# Altium schematic sheet 02_CPU.SchDoc
size A3
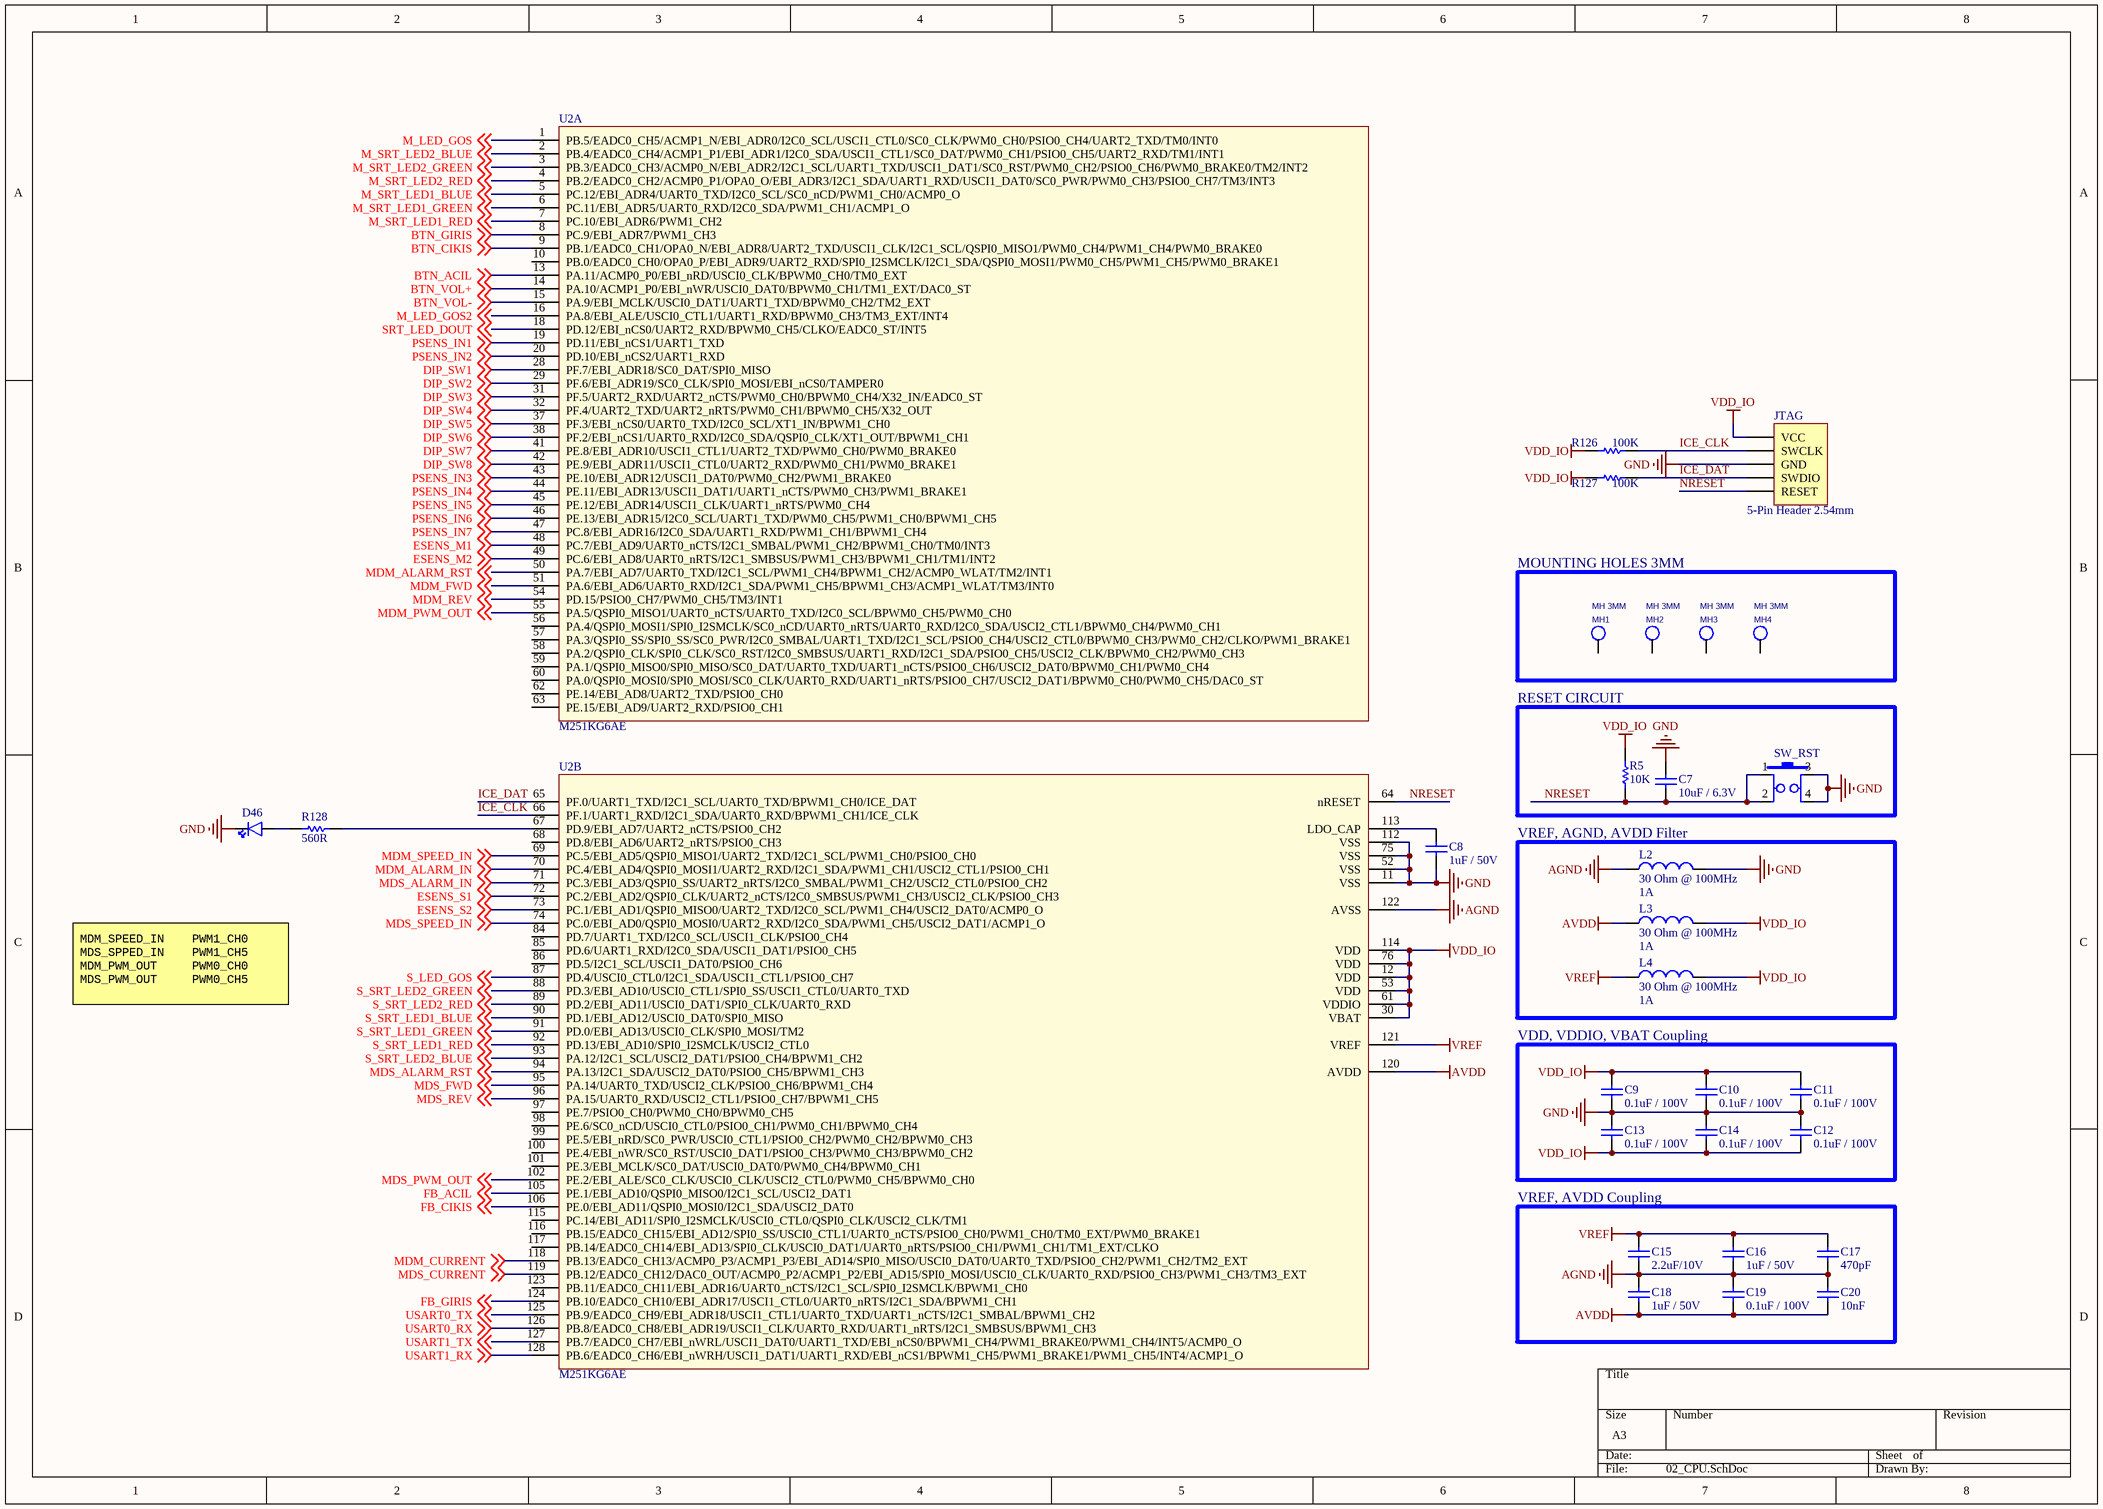
[diagram p0: 02_CPU.SchDoc]

## Parts
C7  10uF / 6.3V  [603C]
C8  1uF / 50V  [603C]
C9  0.1uF / 100V  [603C]
C10  0.1uF / 100V  [603C]
C11  0.1uF / 100V  [603C]
C12  0.1uF / 100V  [603C]
C13  0.1uF / 100V  [603C]
C14  0.1uF / 100V  [603C]
C15  2.2uF/10V  [603C]
C16  1uF / 50V  [603C]
C17  470pF  [603C]
C18  1uF / 50V  [603C]
C19  0.1uF / 100V  [603C]
C20  10nF  [603C]
D46  led_green  [805LED]  (value not drawn)
JTAG  5-Pin Header 2.54mm  [HDR1X5]  (no BOM)
L2  Current Rating (Max): 1A  [603L]  (hidden comment: 30 Ohm @ 100MHz)
L3  Current Rating (Max): 1A  [603L]  (hidden comment: 30 Ohm @ 100MHz)
L4  Current Rating (Max): 1A  [603L]  (hidden comment: 30 Ohm @ 100MHz)
MH1  MH 3MM  [MH 3.0MM HOLE 5MM PAD]  (no BOM)
MH2  MH 3MM  [MH 3.0MM HOLE 5MM PAD]  (no BOM)
MH3  MH 3MM  [MH 3.0MM HOLE 5MM PAD]  (no BOM)
MH4  MH 3MM  [MH 3.0MM HOLE 5MM PAD]  (no BOM)
R5  10K  [603R]
R126  100K  [603R]
R127  100K  [603R]
R128  560R  [603R]
SW_RST  switch tactile  [SW_TACTILE_6X6mm SMT]  (value not drawn)
U2  M251KG6AE  [TSQFP40P1600X1600X160-128N]  (parts A,B of 2)

## Blocks framed on the sheet
MOUNTING HOLES 3MM: MH1-MH4
RESET CIRCUIT: C7 R5 SW_RST
VREF, AGND, AVDD Filter: L2-L4
VDD, VDDIO, VBAT Coupling: C9-C14
VREF, AVDD Coupling: C15-C20

## Nets
AGND: C15.1 C16.1 C17.1 C18.2 C19.2 C20.2 L2.1 U2.122(AVSS)
AVDD: C18.1 C19.1 C20.1 L3.1 U2.120(AVDD)
GND: C7.1 C8.1 C9.1 C10.1 C11.1 C12.1 C13.2 C14.2 D46.2(K) JTAG.3(GND) L2.2 SW_RST.3 SW_RST.4 U2.11(VSS) U2.52(VSS) U2.75(VSS) U2.112(VSS)
VDD_IO: C9.2 C10.2 C11.2 C12.2 C13.1 C14.1 JTAG.1(VCC) L3.2 L4.2 R5.2 R126.1 R127.1 U2.12(VDD) U2.30(VBAT) U2.53(VDD) U2.61(VDDIO) U2.76(VDD) U2.114(VDD)
VREF: C15.2 C16.2 C17.2 L4.1 U2.121(VREF)
BTN_ACIL: U2.13(PA.11/ACMP0_P0/EBI_nRD/USCI0_CLK/BPWM0_CH0/TM0_EXT) ; off-sheet BTN_ACIL
BTN_CIKIS: U2.9(PB.1/EADC0_CH1/OPA0_N/EBI_ADR8/UART2_TXD/USCI1_CLK/I2C1_SCL/QSPI0_MISO1/PWM0_CH4/PWM1_CH4/PWM0_BRAKE0) ; off-sheet BTN_CIKIS
BTN_GIRIS: U2.8(PC.9/EBI_ADR7/PWM1_CH3) ; off-sheet BTN_GIRIS
BTN_VOL+: U2.14(PA.10/ACMP1_P0/EBI_nWR/USCI0_DAT0/BPWM0_CH1/TM1_EXT/DAC0_ST) ; off-sheet BTN_VOL+
BTN_VOL-: U2.15(PA.9/EBI_MCLK/USCI0_DAT1/UART1_TXD/BPWM0_CH2/TM2_EXT) ; off-sheet BTN_VOL-
DIP_SW1: U2.28(PF.7/EBI_ADR18/SC0_DAT/SPI0_MISO) ; off-sheet DIP_SW1
DIP_SW2: U2.29(PF.6/EBI_ADR19/SC0_CLK/SPI0_MOSI/EBI_nCS0/TAMPER0) ; off-sheet DIP_SW2
DIP_SW3: U2.31(PF.5/UART2_RXD/UART2_nCTS/PWM0_CH0/BPWM0_CH4/X32_IN/EADC0_ST) ; off-sheet DIP_SW3
DIP_SW4: U2.32(PF.4/UART2_TXD/UART2_nRTS/PWM0_CH1/BPWM0_CH5/X32_OUT) ; off-sheet DIP_SW4
DIP_SW5: U2.37(PF.3/EBI_nCS0/UART0_TXD/I2C0_SCL/XT1_IN/BPWM1_CH0) ; off-sheet DIP_SW5
DIP_SW6: U2.38(PF.2/EBI_nCS1/UART0_RXD/I2C0_SDA/QSPI0_CLK/XT1_OUT/BPWM1_CH1) ; off-sheet DIP_SW6
DIP_SW7: U2.41(PE.8/EBI_ADR10/USCI1_CTL1/UART2_TXD/PWM0_CH0/PWM0_BRAKE0) ; off-sheet DIP_SW7
DIP_SW8: U2.42(PE.9/EBI_ADR11/USCI1_CTL0/UART2_RXD/PWM0_CH1/PWM0_BRAKE1) ; off-sheet DIP_SW8
ESENS_M1: U2.48(PC.7/EBI_AD9/UART0_nCTS/I2C1_SMBAL/PWM1_CH2/BPWM1_CH0/TM0/INT3) ; off-sheet ESENS_M1
ESENS_M2: U2.49(PC.6/EBI_AD8/UART0_nRTS/I2C1_SMBSUS/PWM1_CH3/BPWM1_CH1/TM1/INT2) ; off-sheet ESENS_M2
ESENS_S1: U2.72(PC.2/EBI_AD2/QSPI0_CLK/UART2_nCTS/I2C0_SMBSUS/PWM1_CH3/USCI2_CLK/PSIO0_CH3) ; off-sheet ESENS_S1
ESENS_S2: U2.73(PC.1/EBI_AD1/QSPI0_MISO0/UART2_TXD/I2C0_SCL/PWM1_CH4/USCI2_DAT0/ACMP0_O) ; off-sheet ESENS_S2
FB_ACIL: U2.105(PE.1/EBI_AD10/QSPI0_MISO0/I2C1_SCL/USCI2_DAT1) ; off-sheet FB_ACIL
FB_CIKIS: U2.106(PE.0/EBI_AD11/QSPI0_MOSI0/I2C1_SDA/USCI2_DAT0) ; off-sheet FB_CIKIS
FB_GIRIS: U2.124(PB.10/EADC0_CH10/EBI_ADR17/USCI1_CTL0/UART0_nRTS/I2C1_SDA/BPWM1_CH1) ; off-sheet FB_GIRIS
ICE_CLK: JTAG.2(SWCLK) R126.2 U2.66(PF.1/UART1_RXD/I2C1_SDA/UART0_RXD/BPWM1_CH1/ICE_CLK)
ICE_DAT: JTAG.4(SWDIO) R127.2 U2.65(PF.0/UART1_TXD/I2C1_SCL/UART0_TXD/BPWM1_CH0/ICE_DAT)
M_LED_GOS: U2.1(PB.5/EADC0_CH5/ACMP1_N/EBI_ADR0/I2C0_SCL/USCI1_CTL0/SC0_CLK/PWM0_CH0/PSIO0_CH4/UART2_TXD/TM0/INT0) ; off-sheet M_LED_GOS
M_LED_GOS2: U2.16(PA.8/EBI_ALE/USCI0_CTL1/UART1_RXD/BPWM0_CH3/TM3_EXT/INT4) ; off-sheet M_LED_GOS2
M_SRT_LED1_BLUE: U2.5(PC.12/EBI_ADR4/UART0_TXD/I2C0_SCL/SC0_nCD/PWM1_CH0/ACMP0_O) ; off-sheet M_SRT_LED1_BLUE
M_SRT_LED1_GREEN: U2.6(PC.11/EBI_ADR5/UART0_RXD/I2C0_SDA/PWM1_CH1/ACMP1_O) ; off-sheet M_SRT_LED1_GREEN
M_SRT_LED1_RED: U2.7(PC.10/EBI_ADR6/PWM1_CH2) ; off-sheet M_SRT_LED1_RED
M_SRT_LED2_BLUE: U2.2(PB.4/EADC0_CH4/ACMP1_P1/EBI_ADR1/I2C0_SDA/USCI1_CTL1/SC0_DAT/PWM0_CH1/PSIO0_CH5/UART2_RXD/TM1/INT1) ; off-sheet M_SRT_LED2_BLUE
M_SRT_LED2_GREEN: U2.3(PB.3/EADC0_CH3/ACMP0_N/EBI_ADR2/I2C1_SCL/UART1_TXD/USCI1_DAT1/SC0_RST/PWM0_CH2/PSIO0_CH6/PWM0_BRAKE0/TM2/INT2) ; off-sheet M_SRT_LED2_GREEN
M_SRT_LED2_RED: U2.4(PB.2/EADC0_CH2/ACMP0_P1/OPA0_O/EBI_ADR3/I2C1_SDA/UART1_RXD/USCI1_DAT0/SC0_PWR/PWM0_CH3/PSIO0_CH7/TM3/INT3) ; off-sheet M_SRT_LED2_RED
MDM_ALARM_IN: U2.70(PC.4/EBI_AD4/QSPI0_MOSI1/UART2_RXD/I2C1_SDA/PWM1_CH1/USCI2_CTL1/PSIO0_CH1) ; off-sheet MDM_ALARM_IN
MDM_ALARM_RST: U2.50(PA.7/EBI_AD7/UART0_TXD/I2C1_SCL/PWM1_CH4/BPWM1_CH2/ACMP0_WLAT/TM2/INT1) ; off-sheet MDM_ALARM_RST
MDM_CURRENT: U2.118(PB.13/EADC0_CH13/ACMP0_P3/ACMP1_P3/EBI_AD14/SPI0_MISO/USCI0_DAT0/UART0_TXD/PSIO0_CH2/PWM1_CH2/TM2_EXT) ; off-sheet MDM_CURRENT
MDM_FWD: U2.51(PA.6/EBI_AD6/UART0_RXD/I2C1_SDA/PWM1_CH5/BPWM1_CH3/ACMP1_WLAT/TM3/INT0) ; off-sheet MDM_FWD
MDM_PWM_OUT: U2.55(PA.5/QSPI0_MISO1/UART0_nCTS/UART0_TXD/I2C0_SCL/BPWM0_CH5/PWM0_CH0) ; off-sheet MDM_PWM_OUT
MDM_REV: U2.54(PD.15/PSIO0_CH7/PWM0_CH5/TM3/INT1) ; off-sheet MDM_REV
MDM_SPEED_IN: U2.69(PC.5/EBI_AD5/QSPI0_MISO1/UART2_TXD/I2C1_SCL/PWM1_CH0/PSIO0_CH0) ; off-sheet MDM_SPEED_IN
MDS_ALARM_IN: U2.71(PC.3/EBI_AD3/QSPI0_SS/UART2_nRTS/I2C0_SMBAL/PWM1_CH2/USCI2_CTL0/PSIO0_CH2) ; off-sheet MDS_ALARM_IN
MDS_ALARM_RST: U2.94(PA.13/I2C1_SDA/USCI2_DAT0/PSIO0_CH5/BPWM1_CH3) ; off-sheet MDS_ALARM_RST
MDS_CURRENT: U2.119(PB.12/EADC0_CH12/DAC0_OUT/ACMP0_P2/ACMP1_P2/EBI_AD15/SPI0_MOSI/USCI0_CLK/UART0_RXD/PSIO0_CH3/PWM1_CH3/TM3_EXT) ; off-sheet MDS_CURRENT
MDS_FWD: U2.95(PA.14/UART0_TXD/USCI2_CLK/PSIO0_CH6/BPWM1_CH4) ; off-sheet MDS_FWD
MDS_PWM_OUT: U2.102(PE.2/EBI_ALE/SC0_CLK/USCI0_CLK/USCI2_CTL0/PWM0_CH5/BPWM0_CH0) ; off-sheet MDS_PWM_OUT
MDS_REV: U2.96(PA.15/UART0_RXD/USCI2_CTL1/PSIO0_CH7/BPWM1_CH5) ; off-sheet MDS_REV
MDS_SPEED_IN: U2.74(PC.0/EBI_AD0/QSPI0_MOSI0/UART2_RXD/I2C0_SDA/PWM1_CH5/USCI2_DAT1/ACMP1_O) ; off-sheet MDS_SPEED_IN
NRESET: C7.2 JTAG.5(RESET) R5.1 SW_RST.1 SW_RST.2 U2.64(nRESET)
PSENS_IN1: U2.19(PD.11/EBI_nCS1/UART1_TXD) ; off-sheet PSENS_IN1
PSENS_IN2: U2.20(PD.10/EBI_nCS2/UART1_RXD) ; off-sheet PSENS_IN2
PSENS_IN3: U2.43(PE.10/EBI_ADR12/USCI1_DAT0/PWM0_CH2/PWM1_BRAKE0) ; off-sheet PSENS_IN3
PSENS_IN4: U2.44(PE.11/EBI_ADR13/USCI1_DAT1/UART1_nCTS/PWM0_CH3/PWM1_BRAKE1) ; off-sheet PSENS_IN4
PSENS_IN5: U2.45(PE.12/EBI_ADR14/USCI1_CLK/UART1_nRTS/PWM0_CH4) ; off-sheet PSENS_IN5
PSENS_IN6: U2.46(PE.13/EBI_ADR15/I2C0_SCL/UART1_TXD/PWM0_CH5/PWM1_CH0/BPWM1_CH5) ; off-sheet PSENS_IN6
PSENS_IN7: U2.47(PC.8/EBI_ADR16/I2C0_SDA/UART1_RXD/PWM1_CH1/BPWM1_CH4) ; off-sheet PSENS_IN7
S_LED_GOS: U2.87(PD.4/USCI0_CTL0/I2C1_SDA/USCI1_CTL1/PSIO0_CH7) ; off-sheet S_LED_GOS
S_SRT_LED1_BLUE: U2.90(PD.1/EBI_AD12/USCI0_DAT0/SPI0_MISO) ; off-sheet S_SRT_LED1_BLUE
S_SRT_LED1_GREEN: U2.91(PD.0/EBI_AD13/USCI0_CLK/SPI0_MOSI/TM2) ; off-sheet S_SRT_LED1_GREEN
S_SRT_LED1_RED: U2.92(PD.13/EBI_AD10/SPI0_I2SMCLK/USCI2_CTL0) ; off-sheet S_SRT_LED1_RED
S_SRT_LED2_BLUE: U2.93(PA.12/I2C1_SCL/USCI2_DAT1/PSIO0_CH4/BPWM1_CH2) ; off-sheet S_SRT_LED2_BLUE
S_SRT_LED2_GREEN: U2.88(PD.3/EBI_AD10/USCI0_CTL1/SPI0_SS/USCI1_CTL0/UART0_TXD) ; off-sheet S_SRT_LED2_GREEN
S_SRT_LED2_RED: U2.89(PD.2/EBI_AD11/USCI0_DAT1/SPI0_CLK/UART0_RXD) ; off-sheet S_SRT_LED2_RED
SRT_LED_DOUT: U2.18(PD.12/EBI_nCS0/UART2_RXD/BPWM0_CH5/CLKO/EADC0_ST/INT5) ; off-sheet SRT_LED_DOUT
USART0_RX: U2.126(PB.8/EADC0_CH8/EBI_ADR19/USCI1_CLK/UART0_RXD/UART1_nRTS/I2C1_SMBSUS/BPWM1_CH3) ; off-sheet USART0_RX
USART0_TX: U2.125(PB.9/EADC0_CH9/EBI_ADR18/USCI1_CTL1/UART0_TXD/UART1_nCTS/I2C1_SMBAL/BPWM1_CH2) ; off-sheet USART0_TX
USART1_RX: U2.128(PB.6/EADC0_CH6/EBI_nWRH/USCI1_DAT1/UART1_RXD/EBI_nCS1/BPWM1_CH5/PWM1_BRAKE1/PWM1_CH5/INT4/ACMP1_O) ; off-sheet USART1_RX
USART1_TX: U2.127(PB.7/EADC0_CH7/EBI_nWRL/USCI1_DAT0/UART1_TXD/EBI_nCS0/BPWM1_CH4/PWM1_BRAKE0/PWM1_CH4/INT5/ACMP0_O) ; off-sheet USART1_TX
NetC8_2: C8.2 U2.113(LDO_CAP)
NetD46_1: D46.1(A) R128.2
NetR128_1: R128.1 U2.67(PD.9/EBI_AD7/UART2_nCTS/PSIO0_CH2)

Not connected (* = marked no-connect by the designer): MH1 1; MH2 1; MH3 1; MH4 1; U2 10(PB.0/EADC0_CH0/OPA0_P/EBI_ADR9/UART2_RXD/SPI0_I2SMCLK/I2C1_SDA/QSPI0_MOSI1/PWM0_CH5/PWM1_CH5/PWM0_BRAKE1) 56(PA.4/QSPI0_MOSI1/SPI0_I2SMCLK/SC0_nCD/UART0_nRTS/UART0_RXD/I2C0_SDA/USCI2_CTL1/BPWM0_CH4/PWM0_CH1) 57(PA.3/QSPI0_SS/SPI0_SS/SC0_PWR/I2C0_SMBAL/UART1_TXD/I2C1_SCL/PSIO0_CH4/USCI2_CTL0/BPWM0_CH3/PWM0_CH2/CLKO/PWM1_BRAKE1) 58(PA.2/QSPI0_CLK/SPI0_CLK/SC0_RST/I2C0_SMBSUS/UART1_RXD/I2C1_SDA/PSIO0_CH5/USCI2_CLK/BPWM0_CH2/PWM0_CH3) 59(PA.1/QSPI0_MISO0/SPI0_MISO/SC0_DAT/UART0_TXD/UART1_nCTS/PSIO0_CH6/USCI2_DAT0/BPWM0_CH1/PWM0_CH4) 60(PA.0/QSPI0_MOSI0/SPI0_MOSI/SC0_CLK/UART0_RXD/UART1_nRTS/PSIO0_CH7/USCI2_DAT1/BPWM0_CH0/PWM0_CH5/DAC0_ST) 62(PE.14/EBI_AD8/UART2_TXD/PSIO0_CH0) 63(PE.15/EBI_AD9/UART2_RXD/PSIO0_CH1) 68(PD.8/EBI_AD6/UART2_nRTS/PSIO0_CH3) 84(PD.7/UART1_TXD/I2C0_SCL/USCI1_CLK/PSIO0_CH4) 85(PD.6/UART1_RXD/I2C0_SDA/USCI1_DAT1/PSIO0_CH5) 86(PD.5/I2C1_SCL/USCI1_DAT0/PSIO0_CH6) 97(PE.7/PSIO0_CH0/PWM0_CH0/BPWM0_CH5) 98(PE.6/SC0_nCD/USCI0_CTL0/PSIO0_CH1/PWM0_CH1/BPWM0_CH4) 99(PE.5/EBI_nRD/SC0_PWR/USCI0_CTL1/PSIO0_CH2/PWM0_CH2/BPWM0_CH3) 100(PE.4/EBI_nWR/SC0_RST/USCI0_DAT1/PSIO0_CH3/PWM0_CH3/BPWM0_CH2) 101(PE.3/EBI_MCLK/SC0_DAT/USCI0_DAT0/PWM0_CH4/BPWM0_CH1) 115(PC.14/EBI_AD11/SPI0_I2SMCLK/USCI0_CTL0/QSPI0_CLK/USCI2_CLK/TM1) 116(PB.15/EADC0_CH15/EBI_AD12/SPI0_SS/USCI0_CTL1/UART0_nCTS/PSIO0_CH0/PWM1_CH0/TM0_EXT/PWM0_BRAKE1) 117(PB.14/EADC0_CH14/EBI_AD13/SPI0_CLK/USCI0_DAT1/UART0_nRTS/PSIO0_CH1/PWM1_CH1/TM1_EXT/CLKO) 123(PB.11/EADC0_CH11/EBI_ADR16/UART0_nCTS/I2C1_SCL/SPI0_I2SMCLK/BPWM1_CH0)

## Notes on the sheet
- MDM_SPEED_IN    PWM1_CH0
  MDS_SPPED_IN    PWM1_CH5
  MDM_PWM_OUT     PWM0_CH0
  MDS_PWM_OUT     PWM0_CH5

## Library data of the parts
C7 = CAP_CER 10UF 6.3V X5R 0603: 10µF ±20% 6.3V Ceramic Capacitor X5R 0603 (1608 Metric); Manufacturer: Samsung Electro-Mechanics; Manufacturer Part Number: CL10A106MQ8NNNC; Tolerance: ±10%; Value: 10uF / 6.3V; Digi-Key Part Number: 1276-1119-1-ND; Voltage - Rated: 6.3V; Temperature Coefficient: X5R; Operating Temperature: -55°C ~ 85°C; Applications: General Purpose; Package / Case: 0603 (1608 Metric)
C8 C16 C18 = CAP CER 1UF 50V X5R 0603: 1µF ±10% 50V Ceramic Capacitor X5R 0603 (1608 Metric); Manufacturer: Samsung Electro-Mechanics; Value: 1uF / 50V; Digi-Key Part Number: 1276-1860-2-ND; Tolerance: ±10%; Voltage - Rated: 50V; Temperature Coefficient: X5R; Operating Temperature: -55°C ~ 85°C; Applications: General Purpose; Package / Case: 0603 (1608 Metric)
C9-C14 C19 = CAP CER 0.1UF 100V X7R 0603: 0.1 µF ±10% 100V Ceramic Capacitor X7R 0603 (1608 Metric); Manufacturer: Venkel; Manufacturer Part Number: C0603X7R101-104KNP; Value: 0.1uF / 100V; Digi-Key Part Number: 2679-C0603X7R101-104KNPTR-ND; Tolerance: ±10%; Voltage - Rated: 100V; Temperature Coefficient: X7R; Operating Temperature: -55°C ~ 125°C; Applications: General Purpose; Package / Case: 0603 (1608 Metric)
C15 = CAP CER 2.2UF 10V X5R 0603: 2.2 µF ±10% 10V Ceramic Capacitor X5R 0603 (1608 Metric); Manufacturer: CAL-CHIP ELECTRONICS, INC.; Manufacturer Part Number: GMC10X5R225K10NT; Value: 2.2uF/10V; Digi-Key Part Number: 2571-GMC10X5R225K10NTTR-ND; Tolerance: ±10%; Voltage - Rated: 10V; Temperature Coefficient: X5R; Operating Temperature: -55°C ~ 85°C; Applications: General Purpose; Package / Case: 0603 (1608 Metric)
C17 = CAP_CER_470pF_50V_%5_C0G_NP0_ 0603: 470pF ±5% 50V Ceramic Capacitor C0G, NP0 0603 (1608 Metric); Manufacturer: Samsung Electro-Mechanics America, Inc.; Manufacturer Part Number: CL10C471JB8NNNC; Value: 470pF; Digi-Key Part Number: 1276-1168-2-ND; Tolerance: ±5%; Voltage - Rated: 50V; Temperature Coefficient: C0G, NP0; Operating Temperature: -55°C ~ 125°C; Applications: General Purpose; Package / Case: 0603 (1608 Metric); Size / Dimension: 0.063" L x 0.032" W (1.60mm x 0.80mm); Thickness (Max): 0.035" (0.90mm)
C20 = CAP_CER_10nF_50V_%5_ X7R_ 0603: 10nF ±5% 50V Ceramic Capacitor X7R 0603 (1608 Metric); Manufacturer: Yageo; Manufacturer Part Number: CC0603JRX7R9BB103; Value: 10nF; Digi-Key Part Number: 311-1778-2-ND; Tolerance: ±5%; Voltage - Rated: 50V; Temperature Coefficient: X7R; Operating Temperature: -55°C ~ 125°C; Applications: General Purpose; Package / Case: 0603 (1608 Metric); Size / Dimension: 0.063" L x 0.032" W (1.60mm x 0.80mm); Thickness (Max): 0.035" (0.90mm)
D46 = LED_GREEN_0805: LED 2X1.2MM 570NM GN WTR CLR SMD; Millicandela Rating: 50mcd; Voltage - Forward (Vf): 2.1V; value: led_green; Digi-Key Part Number: 754-1127-1-ND; Case: 0805; Viewing Angle: -
JTAG = STM_JTAG: STM JTAG Header, 5-Pin; Value: 5-Pin Header 2.54mm
L2-L4 = FERRITE BEAD 30 OHM 0603 1LN: 30 Ohms @ 100 MHz 1 Power Line Ferrite Bead 0603 (1608 Metric) 1A 50mOhm; Manufacturer: Murata Electronics; Manufacturer Part Number: BLM18PG300SN1D; Digi-Key Part Number: 490-1035-1-ND; Operating Temperature: -55°C ~ 125°C; Package / Case: 0603 (1608 Metric); Height (Max): 0.037" (0.95mm); Size / Dimension: 0.063" L x 0.032" W (1.60mm x 0.80mm); DC Resistance (DCR) (Max): 50mOhm; Impedance at Frequency: 30 Ohm @ 100MHz
MH1-MH4 = MH 3MMHOLE_5MMPAD: Mountin hole, NPTH Drill 3mm
R5 = RES_10K_OHM_%5_0.1W_0603: 10 kOhms ±5% 0.1W, 1/10W Chip Resistor 0603 (1608 Metric) Moisture Resistant Thick Film; Manufacturer: Yageo; Manufacturer Part Number: RC0603JR-0710KL; Temperature Coefficient: ±100ppm/°C; Value: 10K; Digi-Key Part Number: 311-10KGRTR-ND; Tolerance: ±5%; Power (Watts): 0.1W, 1/10W; Composition: Thick Film; Operating Temperature: -55°C ~ 155°C; Package / Case: 0603 (1608 Metric); Size / Dimension: 0.063" L x 0.032" W (1.60mm x 0.80mm); Height - Seated (Max): 0.022" (0.55mm); Features: Moisture Resistant
R126 R127 = RES_100K OHM 1% 1/10W 0603: 100 kOhms ±1% 0.1W, 1/10W Chip Resistor 0603 (1608 Metric)  Thick Film; Manufacturer: TE Connectivity Passive Product; Manufacturer Part Number: CRG0603F100K; Temperature Coefficient: ±100ppm/°C; Value: 100K; Digi-Key Part Number: A106046TR-ND; Tolerance: ±1%; Power (Watts): 0.1W, 1/10W; Composition: Thick Film; Operating Temperature: -55°C ~ 155°C; Package / Case: 0603 (1608 Metric); Size / Dimension: 0.063" L x 0.032" W (1.60mm x 0.80mm); Height - Seated (Max): 0.022" (0.55mm); Features: Automotive AEC-Q200
R128 = RES_560_OHM_%5_0.1W_0603: 560 Ohms ±5% 0.1W, 1/10W Chip Resistor 0603 (1608 Metric) Moisture Resistant Thick Film; Manufacturer: Yageo; Manufacturer Part Number: RC0603JR-07560RL; Temperature Coefficient: ±100ppm/°C; Value: 560R; Digi-Key Part Number: 311-560GRCT-ND; Tolerance: ±5%; Power (Watts): 0.1W, 1/10W; Composition: Thick Film; Operating Temperature: -55°C ~ 155°C; Package / Case: 0603 (1608 Metric); Size / Dimension: 0.063" L x 0.032" W (1.60mm x 0.80mm); Height - Seated (Max): 0.022" (0.55mm); Features: Moisture Resistant
SW_RST = SW_TACTILE_6x6x4.3mm SMT: Tactile Switch SPST-NO Top Actuated Surface Mount; Switch Function: Off-Mom; Value: switch tactile; Digi-Key Part Number: CKN9112TR-ND; case: 6.00mm x 6.00mm_H4.30mm
U2 = IC MCU 32BIT 256KB FLASH 32KB RAM 128LQFP M251KG6AE: ARM® Cortex®-M23 series Microcontroller IC 32-Bit 48MHz 256KB (256K x 8) FLASH 128-LQFP (14x14); Voltage - Supply (Vcc/Vdd): 1.75V ~ 5.5V; Oscillator Type: Internal; Value: M251KG6AE; Core Processor: ARM® Cortex®-M23; Speed: 48MHz; Package / Case: 128-LQFP (14x14); Operating Temperature: -40°C ~ 105°C (TA); Digi-Key Part Number: https://www.ozdisan.com/integrated-circuits-ics/embedded-ics/microcontrollers/M251KG6AE